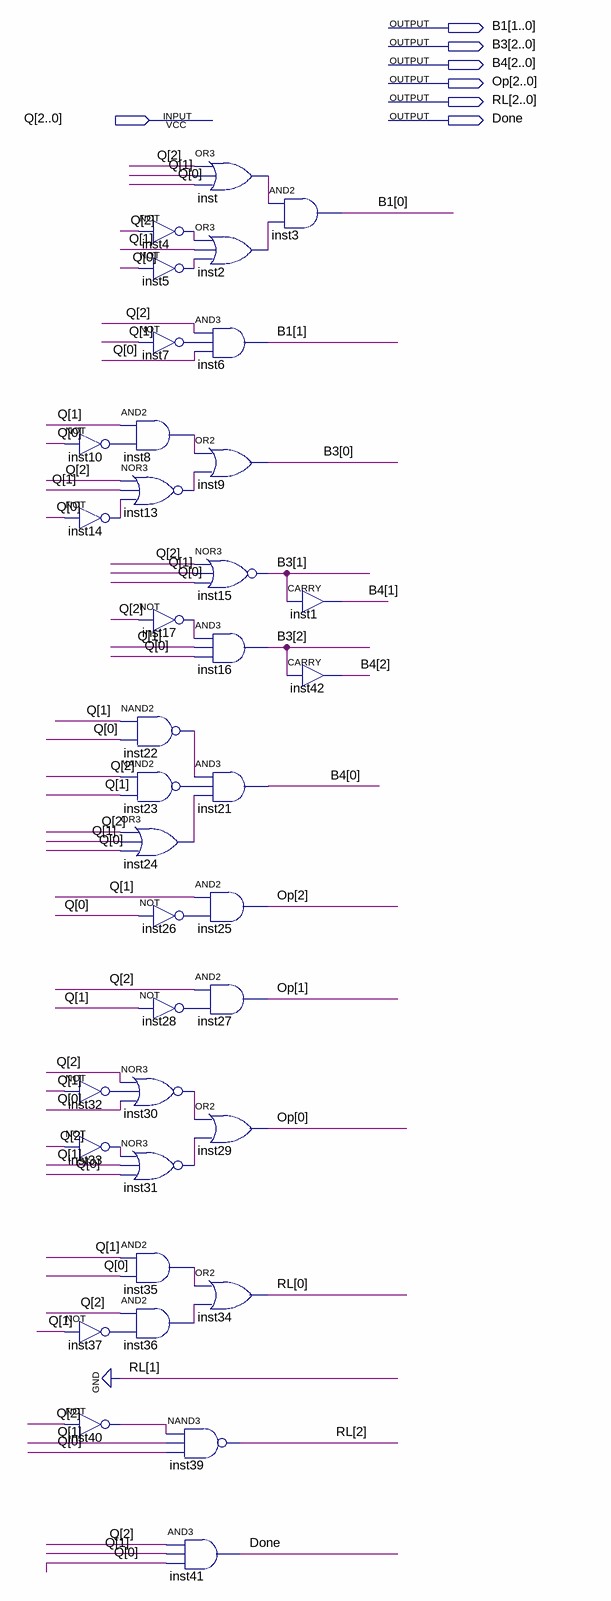
[diagram p0: schematic sheet]
// Quartus schematic Outputlogic_version4.bdf as structural Verilog: 37 symbols, 7 pins
module Outputlogic_version4 (
  input  [2:0] Q,
  output [1:0] B1,
  output [2:0] B3,
  output [2:0] B4,
  output [2:0] Op,
  output [2:0] RL,
  output Done
);

  wire inst2_out, inst4_out, inst5_out, inst7_out, inst8_out, inst10_out, inst13_out, inst14_out, inst17_out,
       inst22_out, inst23_out, inst24_out, inst26_out, inst28_out, inst30_out, inst31_out, inst32_out,
       inst33_out, inst35_out, inst36_out, inst37_out, inst40_out, inst_out;

  not inst10 (inst10_out, Q[0]);
  not inst14 (inst14_out, Q[0]);
  not inst32 (inst32_out, Q[1]);
  not inst33 (inst33_out, Q[2]);
  not inst37 (inst37_out, Q[1]);
  not inst40 (inst40_out, Q[2]);
  not inst4 (inst4_out, Q[2]);
  not inst5 (inst5_out, Q[0]);
  not inst7 (inst7_out, Q[1]);
  and inst8 (inst8_out, Q[1], inst10_out);
  nor inst13 (inst13_out, Q[2], Q[1], inst14_out);
  not inst17 (inst17_out, Q[2]);
  nand inst22 (inst22_out, Q[1], Q[0]);
  nand inst23 (inst23_out, Q[2], Q[1]);
  or inst24 (inst24_out, Q[2], Q[1], Q[0]);
  not inst26 (inst26_out, Q[0]);
  not inst28 (inst28_out, Q[1]);
  nor inst30 (inst30_out, Q[2], inst32_out, Q[0]);
  nor inst31 (inst31_out, inst33_out, Q[1], Q[0]);
  and inst35 (inst35_out, Q[1], Q[0]);
  and inst36 (inst36_out, Q[2], inst37_out);
  or inst (inst_out, Q[2], Q[1], Q[0]);
  or inst2 (inst2_out, inst4_out, Q[1], inst5_out);
  and inst6 (B1[1], Q[2], inst7_out, Q[0]);
  or inst9 (B3[0], inst8_out, inst13_out);
  nor inst15 (B3[1], Q[2], Q[1], Q[0]);
  and inst16 (B3[2], inst17_out, Q[1], Q[0]);
  and inst21 (B4[0], inst22_out, inst23_out, inst24_out);
  and inst25 (Op[2], Q[1], inst26_out);
  and inst27 (Op[1], Q[2], inst28_out);
  or inst29 (Op[0], inst30_out, inst31_out);
  or inst34 (RL[0], inst35_out, inst36_out);
  nand inst39 (RL[2], inst40_out, Q[1], Q[0]);
  and inst41 (Done, Q[2], Q[1], Q[0]);
  and inst3 (B1[0], inst_out, inst2_out);
  CARRY inst1 (.IN(B3[1]), .OUT(B4[1]));
  CARRY inst42 (.IN(B3[2]), .OUT(B4[2]));

  assign RL[1] = 1'b0;
endmodule
